# EAGLE schematic ihc_mon (EAGLE 7.6.0)
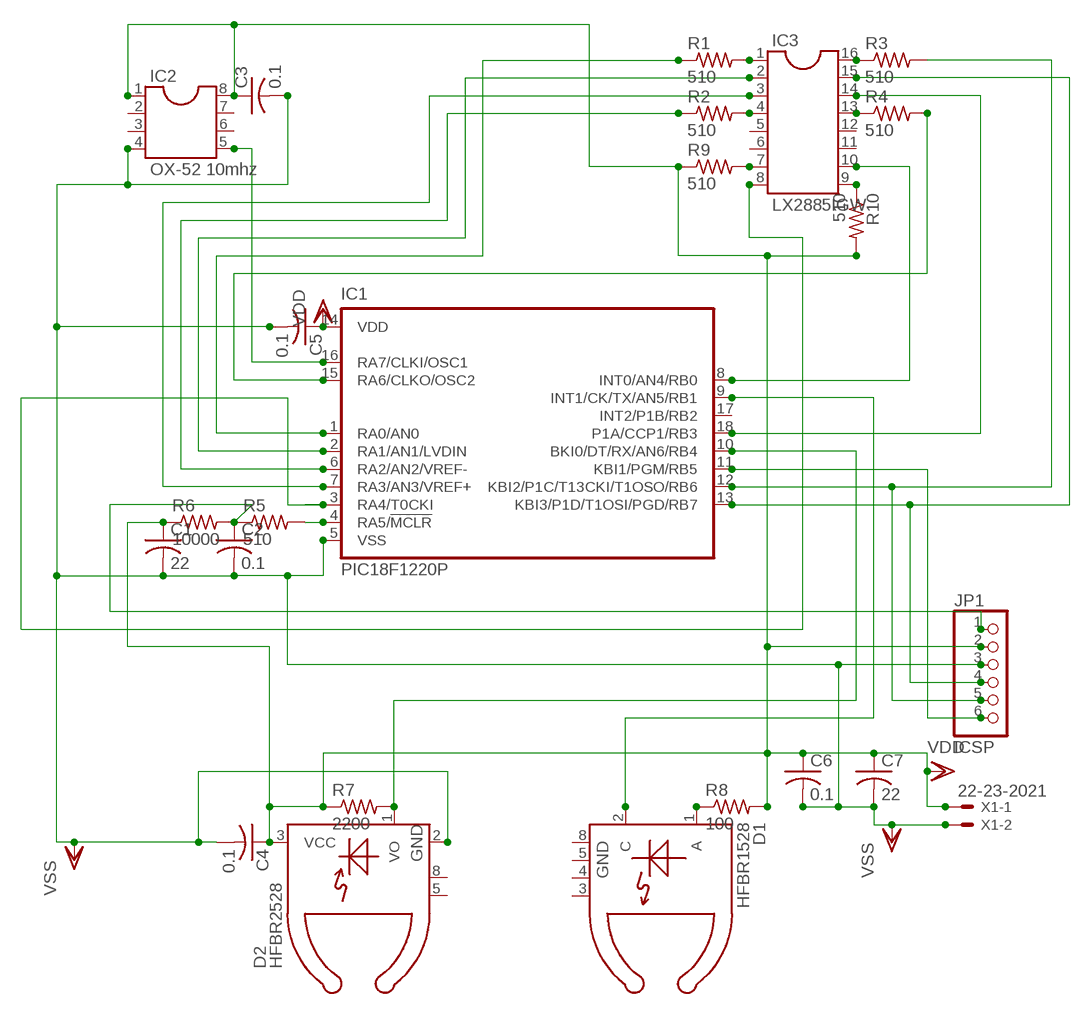
[diagram p0: schematic, sheet 1]

## Parts
C1  22  C-US025-024X044  [C025-024X044]
C2  0.1  C-US050-025X075  [C050-025X075]
C3  0.1  C-US050-025X075  [C050-025X075]
C4  0.1  C-US050-025X075  [C050-025X075]
C5  0.1  C-US050-025X075  [C050-025X075]
C6  0.1  C-US050-025X075  [C050-025X075]
C7  22  C-US025-024X044  [C025-024X044]
D1  HFBR1528  [HFBR25XX]
D2  HFBR2528  [HFBR25XX]
IC1  PIC18F1220P  [DIL18]
IC2  OX-52 10mhz  DIL8S  [SOCKET-08]
IC3  LX2885IGW  DIL16S  [SOCKET-16]
JP1  ICSP  PINHD-1X6  [1X06]
R1  510  R-US_0204/2V  [0204V]
R2  510  R-US_0204/2V  [0204V]
R3  510  R-US_0204/2V  [0204V]
R4  510  R-US_0204/2V  [0204V]
R5  510  R-US_0204/2V  [0204V]
R6  10000  R-US_0204/2V  [0204V]
R7  2200  R-US_0204/2V  [0204V]
R8  100  R-US_0204/2V  [0204V]
R9  510  R-US_0204/2V  [0204V]
R10  510  R-US_0204/2V  [0204V]
X1  22-23-2021  [22-23-2021]

## Nets
N$1: IC3.1 R1.2
N$2: IC3.4 R2.2
N$3: IC3.16 R3.1
N$4: IC3.13 R4.1
N$5: IC1.4(RA5/!MCLR) R5.2
N$6: C2.1 JP1.1 R5.1 R6.2
N$7: D2.1(VO) IC1.10(BKI0/DT/RX/AN6/RB4) R7.2
N$8: D1.1(A) R8.1
N$9: IC3.7 R9.2
N$11: IC1.8(INT0/AN4/RB0) IC3.10
N$14: D1.2(C) IC1.9(INT1/CK/TX/AN5/RB1)
N$15: IC1.11(KBI1/PGM/RB5) JP1.6
N$16: IC1.1(RA0/AN0) R1.1
N$17: IC1.2(RA1/AN1/LVDIN) IC3.2
N$18: IC1.6(RA2/AN2/VREF-) R2.1
N$19: IC1.7(RA3/AN3/VREF+) IC3.3
N$20: IC1.12(KBI2/P1C/T13CKI/T1OSO/RB6) JP1.5 R3.2
N$21: IC1.13(KBI3/P1D/T1OSI/PGD/RB7) IC3.15 JP1.4
N$22: IC1.15(RA6/CLKO/OSC2) R4.2
N$23: IC1.18(P1A/CCP1/RB3) IC3.14
N$24: IC1.3(RA4/T0CKI) IC3.8
N$25: IC1.16(RA7/CLKI/OSC1) IC2.5
N$26: IC3.9 R10.1
VDD: C1.1 C3.1 C4.1 C5.1 C6.1 C7.1 D2.3(VCC) IC1.14(VDD) IC2.1 IC2.8 JP1.2 R6.1 R7.1 R8.2 R9.1 R10.2 X1.1
VSS: C1.2 C2.2 C3.2 C4.2 C5.2 C6.2 C7.2 D2.2(GND) IC1.5(VSS) IC2.4 JP1.3 X1.2
Unconnected: D1.3 D1.4 D1.5(GND) D1.8(GND) D2.5 D2.8 IC1.17(INT2/P1B/RB2) IC2.2 IC2.3 IC2.6 IC2.7 IC3.5 IC3.6 IC3.11 IC3.12

## Library data of the parts
C1-C7 = resistor:C-US: CAPACITOR, American symbol
D1 = opto-transmittter-hp:HFBR1528: OPTO TRANSMITTER; MF: AGILENT TECHNOLOGIES; MPN: HFBR-1528; OC_FARNELL: 1247638; OC_NEWARK: 06F6056
D2 = opto-transmittter-hp:HFBR2528: OPTO RECEIVER; MF: AGILENT TECHNOLOGIES; MPN: HFBR-2528; OC_FARNELL: 1247664; OC_NEWARK: 06F6096
IC1 = microchip:PIC18F1*20: 18/20/28-Pin High-Performance, Enhanced Flash Microcontrollers with 10-bit A/D and nanoWatt Technology Source: ww1.microchip.com/downloads/en/DeviceDoc/39605c.pdf; MF: MICROCHIP; MPN: PIC18F1220-I/P; OC_FARNELL: 9761977; OC_NEWARK: 92C2429
IC2 = ic-package:DIL8: Dual In Line / Socket
IC3 = ic-package:DIL16: Dual In Line / Socket
JP1 = pinhead:PINHD-1X6: PIN HEADER
R1-R10 = resistor:R-US_: RESISTOR, American symbol
X1 = con-molex:22-23-2021: .100" (2.54mm) Center Header - 2 Pin; MF: MOLEX; MPN: 22-23-2021; OC_FARNELL: 1462926; OC_NEWARK: 25C3832